# Altium schematic sheet Gagabiro_supply_acdc_converter.SchDoc: Gagabiro Power Supply AC-DC Converter
size 292 x 193 mm; CheckedBy: None; Author: João Victor Colombari Carlet; CompanyName: School of Engineering of São Carlos; DrawnBy: João Victor Colombari Carlet; Engineer: João Victor Colombari Carlet; Organization: SEL; Address1: EESC - USP; Address2: 400, Trabalhador São-Carlense Av.; Address3: 13566-590, São Carlos; Address4: São Paulo, Brazil; Revision: 0; SheetNumber: 3; SheetTotal: 3
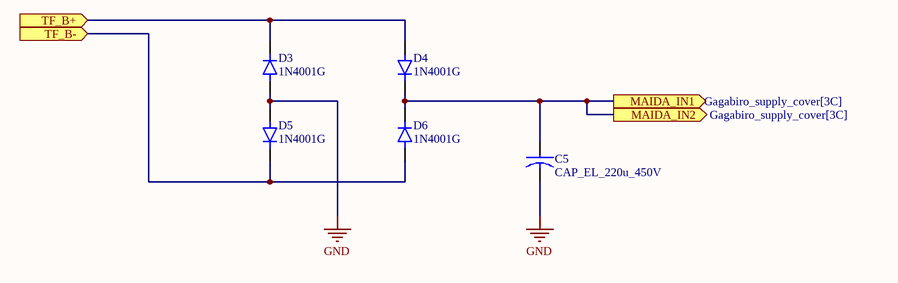
[diagram p0: Gagabiro_supply_acdc_converter.SchDoc]

## Parts
C5  CAP_EL_220u_450V  [CAPPRD500W50D630H1120_stand_25x50]
D3  1N4001G  [DIOAD1036W78L470D235]
D4  1N4001G  [DIOAD1036W78L470D235]
D5  1N4001G  [DIOAD1036W78L470D235]
D6  1N4001G  [DIOAD1036W78L470D235]

## Ports
MAIDA_IN1 (out, see Gagabiro_supply_cover[3C]), MAIDA_IN2 (out, see Gagabiro_supply_cover[3C]), TF_B+ (in, see Gagabiro_supply_cover[2C], Gagabiro_supply_interface[2B]), TF_B- (in, see Gagabiro_supply_cover[2C], Gagabiro_supply_interface[2B])

## Nets
GND: C5.N D3.A D5.A
MAIDA_IN1: C5.P D4.C(K) D6.C(K) ; port MAIDA_IN1, port MAIDA_IN2
TF_B+: D3.C(K) D4.A ; port TF_B+
TF_B-: D5.C(K) D6.A ; port TF_B-

## Notes on the sheet
- Title:
- Drawn By:
- Size:
- Date:
- File:
- A3
- Number:
- Time:
- Revision:
- Sheet
- of
- Website:

## Library data of the parts
C5 = CAP_EL_220u_450V: 220F 16V Aluminum Electrolytic Capacitors Radial, Can 1000 Hrs @ 105C; MP: EEU-HD1C221B; Value: 220uF; MF: Panasonic; Availability: In Stock; Purchase-URL: https://pricing.snapeda.com/search/part/EEU-HD1C221B/?ref=eda; Package: RADIAL-2 Panasonic; Check_prices: https://www.snapeda.com/parts/EEU-HD1C221B/Panasonic/view-part/?ref=eda; SnapEDA_Link: https://www.snapeda.com/parts/EEU-HD1C221B/Panasonic/view-part/?ref=snap; Price: None
D3-D6 = 1N4001G: 1A, 50V, Standard Recovery Rectifier; MF: Taiwan Semiconductor; Package: DO-41-2 Taiwan Semiconductor; Check_prices: https://www.snapeda.com/parts/1N4001G/Taiwan+Semiconductor/view-part/?ref=eda; Value: *; Price: None; MP: 1N4001G; Purchase-URL: https://pricing.snapeda.com/search/part/1N4001G/?ref=eda; SnapEDA_Link: https://www.snapeda.com/parts/1N4001G/Taiwan+Semiconductor/view-part/?ref=snap; Availability: In Stock